# Altium project shkb.PrjPcb
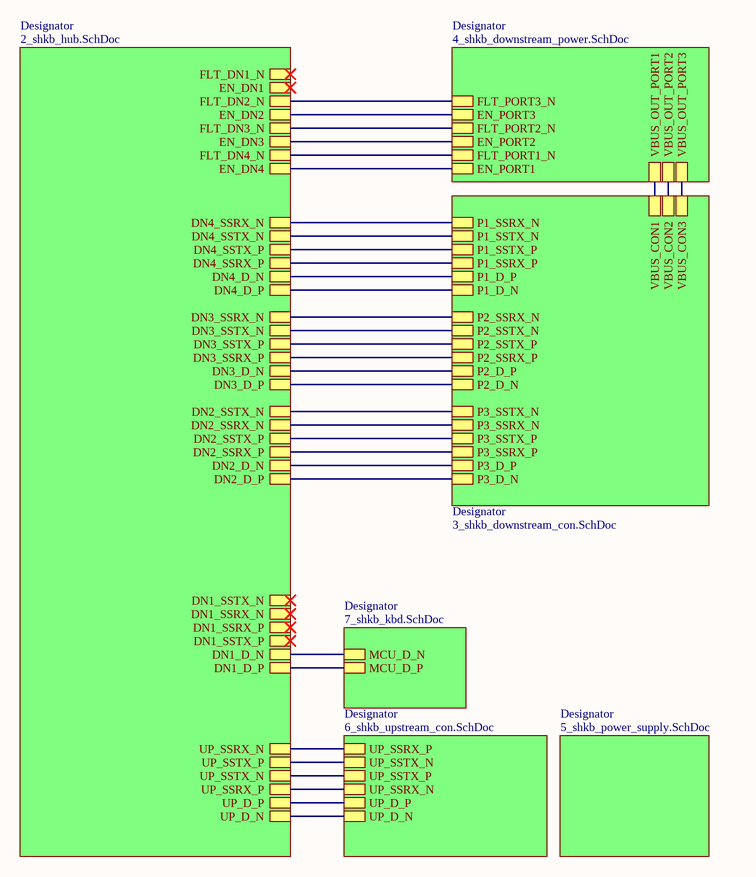
[diagram p0: 1_shkb_top.SchDoc]
ProjectTitle: Steezy Hacking Keyboard Controller; Revision: B3
7 sheets, 143 parts. Net scope: hierarchical (ports join the sheet entries above them; power ports are global).
Board file: shkb.PcbDoc
Sheets:
  1_shkb_top.SchDoc
    Designator = 4_shkb_downstream_power.SchDoc
    Designator = 2_shkb_hub.SchDoc
    Designator = 3_shkb_downstream_con.SchDoc
    Designator = 6_shkb_upstream_con.SchDoc
    Designator = 7_shkb_kbd.SchDoc
    Designator = 5_shkb_power_supply.SchDoc

## Sheet 1_shkb_top.SchDoc: =ProjectTitle
size A4; Address1: github.com/4pplet/SHKB; Address2: Licence: CERN-OHL-S; Revision: B3; SheetNumber: 1; SheetTotal: 7

### Sub-sheets
Designator = 4_shkb_downstream_power.SchDoc: VBUS_OUT_PORT2, FLT_PORT2_N, EN_PORT1, VBUS_OUT_PORT1, FLT_PORT1_N, EN_PORT2, FLT_PORT3_N, VBUS_OUT_PORT3, EN_PORT3
Designator = 2_shkb_hub.SchDoc: FLT_DN2_N, EN_DN2, EN_DN3, EN_DN1, FLT_DN3_N, FLT_DN1_N, FLT_DN4_N, EN_DN4, DN4_D_P, DN1_SSRX_N, DN4_D_N, DN4_SSTX_P, DN4_SSTX_N, DN4_SSRX_P, DN4_SSRX_N, UP_SSRX_P, UP_SSRX_N, UP_SSTX_N, UP_SSTX_P, UP_D_N, UP_D_P, DN3_D_P, DN3_SSRX_P, DN3_SSRX_N, DN3_D_N, DN3_SSTX_P, DN3_SSTX_N, DN2_D_P, DN2_D_N, DN2_SSTX_P, DN2_SSTX_N, DN2_SSRX_P, DN2_SSRX_N, DN1_D_P, DN1_D_N, DN1_SSTX_P, DN1_SSTX_N, DN1_SSRX_P
Designator = 3_shkb_downstream_con.SchDoc: VBUS_CON1, VBUS_CON2, P2_SSTX_N, P2_SSTX_P, P1_SSTX_N, P1_SSRX_P, P2_SSRX_P, P2_SSRX_N, P1_SSRX_N, P1_D_P, P2_D_N, P2_D_P, P1_SSTX_P, P1_D_N, P3_SSRX_N, VBUS_CON3, P3_SSTX_P, P3_D_P, P3_SSTX_N, P3_D_N, P3_SSRX_P
Designator = 6_shkb_upstream_con.SchDoc: UP_SSRX_N, UP_SSTX_N, UP_D_P, UP_D_N, UP_SSRX_P, UP_SSTX_P
Designator = 7_shkb_kbd.SchDoc: MCU_D_P, MCU_D_N
Designator = 5_shkb_power_supply.SchDoc: no entries

### Nets
MCU_D_N: sheet Designator/DN1_D_N, sheet Designator/MCU_D_N
MCU_D_P: sheet Designator/DN1_D_P, sheet Designator/MCU_D_P
P1_D_N: sheet Designator/DN4_D_P, sheet Designator/P1_D_N
P1_D_P: sheet Designator/DN4_D_N, sheet Designator/P1_D_P
P1_SSRX_N: sheet Designator/DN4_SSRX_N, sheet Designator/P1_SSRX_N
P1_SSRX_P: sheet Designator/DN4_SSRX_P, sheet Designator/P1_SSRX_P
P1_SSTX_N: sheet Designator/DN4_SSTX_N, sheet Designator/P1_SSTX_N
P1_SSTX_P: sheet Designator/DN4_SSTX_P, sheet Designator/P1_SSTX_P
P2_D_N: sheet Designator/DN3_D_P, sheet Designator/P2_D_N
P2_D_P: sheet Designator/DN3_D_N, sheet Designator/P2_D_P
P2_SSRX_N: sheet Designator/DN3_SSRX_N, sheet Designator/P2_SSRX_N
P2_SSRX_P: sheet Designator/DN3_SSRX_P, sheet Designator/P2_SSRX_P
P2_SSTX_N: sheet Designator/DN3_SSTX_N, sheet Designator/P2_SSTX_N
P2_SSTX_P: sheet Designator/DN3_SSTX_P, sheet Designator/P2_SSTX_P
P3_D_N: sheet Designator/DN2_D_P, sheet Designator/P3_D_N
P3_D_P: sheet Designator/DN2_D_N, sheet Designator/P3_D_P
P3_SSRX_N: sheet Designator/DN2_SSRX_N, sheet Designator/P3_SSRX_N
P3_SSRX_P: sheet Designator/DN2_SSRX_P, sheet Designator/P3_SSRX_P
P3_SSTX_N: sheet Designator/DN2_SSTX_N, sheet Designator/P3_SSTX_N
P3_SSTX_P: sheet Designator/DN2_SSTX_P, sheet Designator/P3_SSTX_P
UP_D_N: sheet Designator/UP_D_N, sheet Designator/UP_D_N
UP_D_P: sheet Designator/UP_D_P, sheet Designator/UP_D_P
UP_SSRX_N: sheet Designator/UP_SSRX_P, sheet Designator/UP_SSRX_N
UP_SSRX_P: sheet Designator/UP_SSRX_N, sheet Designator/UP_SSRX_P
UP_SSTX_N: sheet Designator/UP_SSTX_P, sheet Designator/UP_SSTX_N
UP_SSTX_P: sheet Designator/UP_SSTX_N, sheet Designator/UP_SSTX_P
NetC403_2: sheet Designator/VBUS_OUT_PORT1, sheet Designator/VBUS_CON1
NetC406_2: sheet Designator/VBUS_OUT_PORT2, sheet Designator/VBUS_CON2
NetC409_2: sheet Designator/VBUS_OUT_PORT3, sheet Designator/VBUS_CON3
NetR401_1: sheet Designator/EN_PORT1, sheet Designator/EN_DN4
NetR403_1: sheet Designator/EN_PORT2, sheet Designator/EN_DN3
NetR405_1: sheet Designator/EN_PORT3, sheet Designator/EN_DN2
NetU201_43: sheet Designator/FLT_PORT1_N, sheet Designator/FLT_DN4_N
NetU201_44: sheet Designator/FLT_PORT2_N, sheet Designator/FLT_DN3_N
NetU201_47: sheet Designator/FLT_PORT3_N, sheet Designator/FLT_DN2_N

### Notes on the sheet
- Title
- Size:
- Date:
- A4
- Number:
- Time:
- Revision:
- Sheet
- of
- File:

## Sheet 4_shkb_downstream_power.SchDoc: =ProjectTitle
size A4; Address1: github.com/4pplet/SHKB; Address2: Licence: CERN-OHL-S; Revision: B3; SheetNumber: 4; SheetTotal: 7
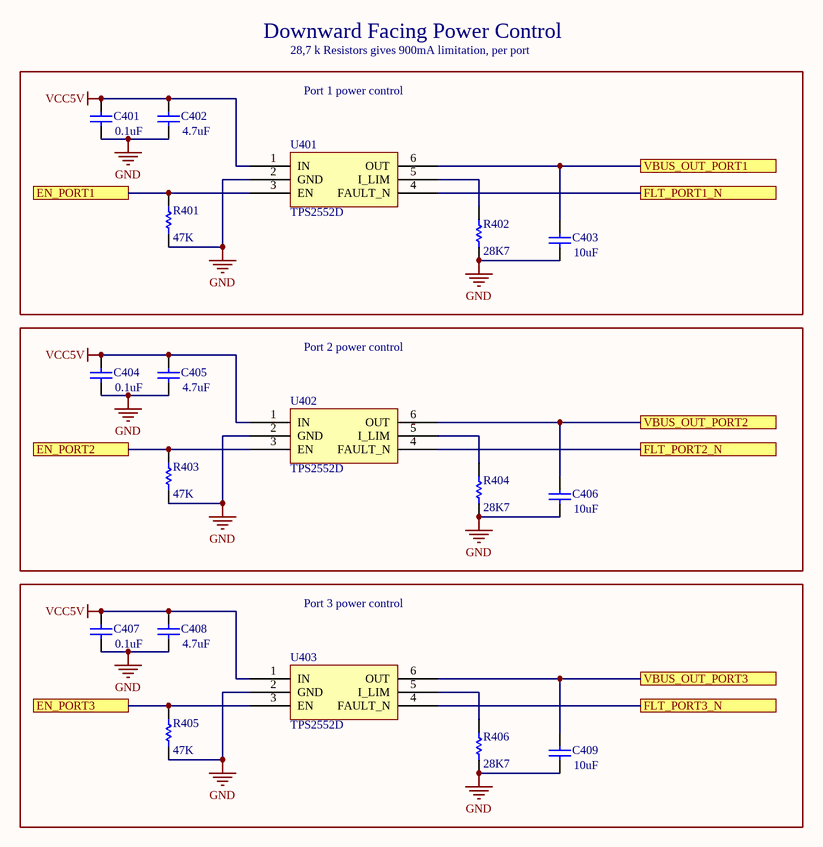
[diagram p1: 4_shkb_downstream_power.SchDoc]

### Parts
C401  value 0.1uF  [C0603[1608]]
C402  value 4.7uF  [C1206[3216]]
C403  value 10uF  [C1206[3216]]
C404  value 0.1uF  [C0603[1608]]
C405  value 4.7uF  [C1206[3216]]
C406  value 10uF  [C1206[3216]]
C407  value 0.1uF  [C0603[1608]]
C408  value 4.7uF  [C1206[3216]]
C409  value 10uF  [C1206[3216]]
R401  value 47K  [R0603[1608]]
R402  value 28K7  [R0603[1608]]
R403  value 47K  [R0603[1608]]
R404  value 28K7  [R0603[1608]]
R405  value 47K  [R0603[1608]]
R406  value 28K7  [R0603[1608]]
U401  TPS2552D  [SOT-23-6]
U402  TPS2552D  [SOT-23-6]
U403  TPS2552D  [SOT-23-6]

### Blocks framed on the sheet
Port 2 power control: C404-C406 R403 R404 U402
Port 3 power control: C407-C409 R405 R406 U403

### Ports
EN_PORT1, EN_PORT2, EN_PORT3, FLT_PORT1_N, FLT_PORT2_N, FLT_PORT3_N, VBUS_OUT_PORT1, VBUS_OUT_PORT2, VBUS_OUT_PORT3

### Nets
GND: C401.1 C402.1 C403.1 C404.1 C405.1 C406.1 C407.1 C408.1 C409.1 R401.2 R402.2 R403.2 R404.2 R405.2 R406.2 U401.2(GND) U402.2(GND) U403.2(GND)
VCC5V: C401.2 C402.2 C404.2 C405.2 C407.2 C408.2 U401.1(IN) U402.1(IN) U403.1(IN)
NetC403_2: C403.2 U401.6(OUT) ; port VBUS_OUT_PORT1
NetC406_2: C406.2 U402.6(OUT) ; port VBUS_OUT_PORT2
NetC409_2: C409.2 U403.6(OUT) ; port VBUS_OUT_PORT3
NetR401_1: R401.1 U401.3(EN) ; port EN_PORT1
NetR402_1: R402.1 U401.5(I_LIM)
NetR403_1: R403.1 U402.3(EN) ; port EN_PORT2
NetR404_1: R404.1 U402.5(I_LIM)
NetR405_1: R405.1 U403.3(EN) ; port EN_PORT3
NetR406_1: R406.1 U403.5(I_LIM)
NetU201_43: U401.4(FAULT_N) ; port FLT_PORT1_N
NetU201_44: U402.4(FAULT_N) ; port FLT_PORT2_N
NetU201_47: U403.4(FAULT_N) ; port FLT_PORT3_N

### Notes on the sheet
- Downward Facing Power Control
- 28,7 k Resistors gives 900mA limitation, per port
- Port 1 power control
- Title
- Size:
- Date:
- A4
- Number:
- Time:
- Revision:
- Sheet
- of
- File:

### Library data of the parts
C401 C404 C407 = Cap: Capacitor; MRF.Part: CC0603KRX7R9BB104; MFG: KEMET; MFGPN: C0603C104M5RACTU; LCSC MFG: YAGEO; Version: 0603 imperial; JLC: BASIC; LCSC Part #: C14663
C402 C405 C408 = Cap: Capacitor; MRF.Part: 1206B475K500NT; MFG: KEMET; MFGPN: C1206C475K4PACTU; LCSC MFG: Guangdong Fenghua Advanced Tech; Version: 1206 imperial; JLC: BASIC; LCSC Part #: C29823
C403 C406 C409 = Cap: Capacitor; MRF.Part: CL31A106KBHNNNE; MFG: KEMET; MFGPN: C1206C106K4PACTU; LCSC MFG: Samsung Electro-Mechanics; Version: 1206 imperial; JLC: BASIC; LCSC Part #: C13585
R401 R403 R405 = Res1: Resistor; MRF.Part: 0603WAF4702T5E; MFG: Vishay Dale; MFGPN: RCA060347K0FKEA; LCSC MFG: Uniroyal Elec; Version: 0603 imperial; JLC: BASIC; LCSC Part #: C25819
R402 R404 R406 = Res1: Resistor; MRF.Part: 0603WAF2872T5E; MFG: Vishay Dale; MFGPN: CRCW060328K7FKEA; LCSC MFG: Uniroyal Elec; Version: 0603 imperial; JLC: BASIC; LCSC Part #: C22928
U401-U403 = TPS2552D: MRF.Part: TPS2552DBVR-1; LCSC MFG: Texas Instruments; LCSC Part #: C140331; JLC: EXTENDED

## Sheet 2_shkb_hub.SchDoc: =ProjectTitle
size A4; Address1: github.com/4pplet/SHKB; Address2: Licence: CERN-OHL-S; Revision: B3; SheetNumber: 2; SheetTotal: 7
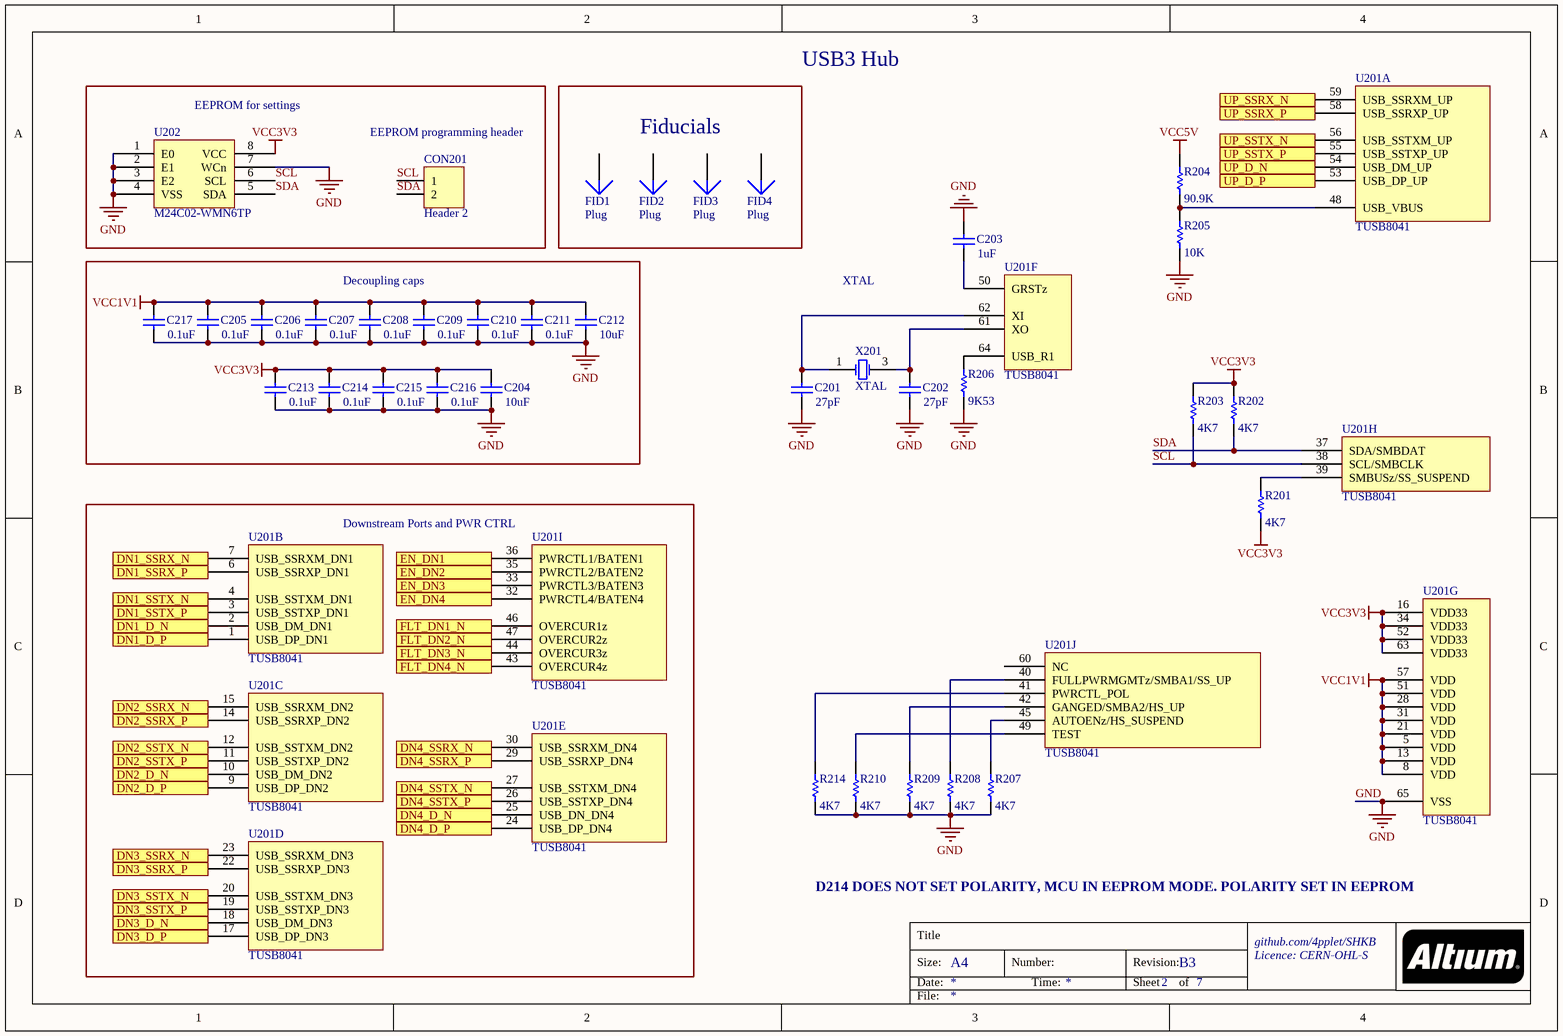
[diagram p2: 2_shkb_hub.SchDoc]

### Parts
C201  value 27pF  [C0603[1608]]
C202  value 27pF  [C0603[1608]]
C203  value 1uF  [C0603[1608]]
C204  value 10uF  [C1206[3216]]
C205  value 0.1uF  [C0402[1005]]
C206  value 0.1uF  [C0402[1005]]
C207  value 0.1uF  [C0402[1005]]
C208  value 0.1uF  [C0402[1005]]
C209  value 0.1uF  [C0402[1005]]
C210  value 0.1uF  [C0603[1608]]
C211  value 0.1uF  [C0603[1608]]
C212  value 10uF  [C1206[3216]]
C213  value 0.1uF  [C0402[1005]]
C214  value 0.1uF  [C0603[1608]]
C215  value 0.1uF  [C0603[1608]]
C216  value 0.1uF  [C0603[1608]]
C217  value 0.1uF  [C0402[1005]]
CON201  Header 2  [HDR1X2]  (no BOM)
FID1  Plug  [Fiducial_Nordic]  (no BOM)
FID2  Plug  [Fiducial_Nordic]  (no BOM)
FID3  Plug  [Fiducial_Nordic]  (no BOM)
FID4  Plug  [Fiducial_Nordic]  (no BOM)
R201  value 4K7  [R0603[1608]]
R202  value 4K7  [R0603[1608]]
R203  value 4K7  [R0603[1608]]
R204  value 90.9K  [R0603[1608]]
R205  value 10K  [R0603[1608]]
R206  value 9K53  [R0402[1005]]
R207  value 4K7  [R0603[1608]]
R208  value 4K7  [R0603[1608]]
R209  value 4K7  [R0603[1608]]
R210  value 4K7  [R0603[1608]]
R214  value 4K7  [R0603[1608]]
U201  TUSB8041  [TUSB8041_VQFN]  (parts A,B,C,D,E,F,G,H,I,J of 10)
U202  M24C02-WMN6TP  [STMicroelectronics M24C02-WMN6TP]
X201  XTAL  [XTAL-3225]

### Blocks framed on the sheet
Decoupling caps: C204-C217
Downstream Ports and PWR CTRL: U201

### Ports
DN1_D_N, DN1_D_P, DN1_SSRX_N, DN1_SSRX_P, DN1_SSTX_N, DN1_SSTX_P, DN2_D_N, DN2_D_P, DN2_SSRX_N, DN2_SSRX_P, DN2_SSTX_N, DN2_SSTX_P, DN3_D_N, DN3_D_P, DN3_SSRX_N, DN3_SSRX_P, DN3_SSTX_N, DN3_SSTX_P, DN4_D_N, DN4_D_P, DN4_SSRX_N, DN4_SSRX_P, DN4_SSTX_N, DN4_SSTX_P, EN_DN1, EN_DN2, EN_DN3, EN_DN4, FLT_DN1_N, FLT_DN2_N, FLT_DN3_N, FLT_DN4_N, UP_D_N, UP_D_P, UP_SSRX_N, UP_SSRX_P, UP_SSTX_N, UP_SSTX_P

### Nets
GND: C201.1 C202.1 C203.2 C204.1 C205.1 C206.1 C207.1 C208.1 C209.1 C210.1 C211.1 C212.1 C213.1 C214.1 C215.1 C216.1 C217.1 R205.2 R206.1 R207.1 R208.1 R209.1 R210.1 R214.1 U201.65(VSS) U202.1(E0) U202.2(E1) U202.3(E2) U202.4(VSS) U202.7(WCn) X201.2(GND) X201.4(GND)
VCC1V1: C205.2 C206.2 C207.2 C208.2 C209.2 C210.2 C211.2 C212.2 C217.2 U201.5(VDD) U201.8(VDD) U201.13(VDD) U201.21(VDD) U201.28(VDD) U201.31(VDD) U201.51(VDD) U201.57(VDD)
VCC3V3: C204.2 C213.2 C214.2 C215.2 C216.2 R201.1 R202.2 R203.2 U201.16(VDD33) U201.34(VDD33) U201.52(VDD33) U201.63(VDD33) U202.8(VCC)
VCC5V: R204.2
MCU_D_N: U201.2(USB_DM_DN1) ; port DN1_D_N
MCU_D_P: U201.1(USB_DP_DN1) ; port DN1_D_P
P1_D_N: U201.24(USB_DP_DN4) ; port DN4_D_P
P1_D_P: U201.25(USB_DN_DN4) ; port DN4_D_N
P1_SSRX_N: U201.30(USB_SSRXM_DN4) ; port DN4_SSRX_N
P1_SSRX_P: U201.29(USB_SSRXP_DN4) ; port DN4_SSRX_P
P1_SSTX_N: U201.27(USB_SSTXM_DN4) ; port DN4_SSTX_N
P1_SSTX_P: U201.26(USB_SSTXP_DN4) ; port DN4_SSTX_P
P2_D_N: U201.17(USB_DP_DN3) ; port DN3_D_P
P2_D_P: U201.18(USB_DM_DN3) ; port DN3_D_N
P2_SSRX_N: U201.23(USB_SSRXM_DN3) ; port DN3_SSRX_N
P2_SSRX_P: U201.22(USB_SSRXP_DN3) ; port DN3_SSRX_P
P2_SSTX_N: U201.20(USB_SSTXM_DN3) ; port DN3_SSTX_N
P2_SSTX_P: U201.19(USB_SSTXP_DN3) ; port DN3_SSTX_P
P3_D_N: U201.9(USB_DP_DN2) ; port DN2_D_P
P3_D_P: U201.10(USB_DM_DN2) ; port DN2_D_N
P3_SSRX_N: U201.15(USB_SSRXM_DN2) ; port DN2_SSRX_N
P3_SSRX_P: U201.14(USB_SSRXP_DN2) ; port DN2_SSRX_P
P3_SSTX_N: U201.12(USB_SSTXM_DN2) ; port DN2_SSTX_N
P3_SSTX_P: U201.11(USB_SSTXP_DN2) ; port DN2_SSTX_P
SCL: CON201.1 R203.1 U201.38(SCL/SMBCLK) U202.6(SCL)
SDA: CON201.2 R202.1 U201.37(SDA/SMBDAT) U202.5(SDA)
UP_D_N: U201.54(USB_DM_UP) ; port UP_D_N
UP_D_P: U201.53(USB_DP_UP) ; port UP_D_P
UP_SSRX_N: U201.58(USB_SSRXP_UP) ; port UP_SSRX_P
UP_SSRX_P: U201.59(USB_SSRXM_UP) ; port UP_SSRX_N
UP_SSTX_N: U201.55(USB_SSTXP_UP) ; port UP_SSTX_P
UP_SSTX_P: U201.56(USB_SSTXM_UP) ; port UP_SSTX_N
NetC201_2: C201.2 U201.62(XI) X201.1(OSC1)
NetC202_2: C202.2 U201.61(XO) X201.3(OSC2)
NetC203_1: C203.1 U201.50(GRSTz)
NetR201_2: R201.2 U201.39(SMBUSz/SS_SUSPEND)
NetR204_1: R204.1 R205.1 U201.48(USB_VBUS)
NetR206_2: R206.2 U201.64(USB_R1)
NetR207_2: R207.2 U201.45(AUTOENz/HS_SUSPEND)
NetR208_2: R208.2 U201.40(FULLPWRMGMTz/SMBA1/SS_UP)
NetR209_2: R209.2 U201.42(GANGED/SMBA2/HS_UP)
NetR210_2: R210.2 U201.49(TEST)
NetR214_2: R214.2 U201.41(PWRCTL_POL)
NetR401_1: U201.32(PWRCTL4/BATEN4) ; port EN_DN4
NetR403_1: U201.33(PWRCTL3/BATEN3) ; port EN_DN3
NetR405_1: U201.35(PWRCTL2/BATEN2) ; port EN_DN2
NetU201_3: U201.3(USB_SSTXP_DN1) ; port DN1_SSTX_P
NetU201_4: U201.4(USB_SSTXM_DN1) ; port DN1_SSTX_N
NetU201_6: U201.6(USB_SSRXP_DN1) ; port DN1_SSRX_P
NetU201_7: U201.7(USB_SSRXM_DN1) ; port DN1_SSRX_N
NetU201_36: U201.36(PWRCTL1/BATEN1) ; port EN_DN1
NetU201_43: U201.43(OVERCUR4z) ; port FLT_DN4_N
NetU201_44: U201.44(OVERCUR3z) ; port FLT_DN3_N
NetU201_46: U201.46(OVERCUR1z) ; port FLT_DN1_N
NetU201_47: U201.47(OVERCUR2z) ; port FLT_DN2_N

Not connected (* = marked no-connect by the designer): FID1 1; FID2 1; FID3 1; FID4 1; U201 60(NC)

### Notes on the sheet
- (near U202) EEPROM for settings
- USB3 Hub
- (near CON201) EEPROM programming header
- Fiducials
- XTAL
- D214 DOES NOT SET POLARITY, MCU IN EEPROM MODE. POLARITY SET IN EEPROM
- Title
- Size:
- Date:
- A4
- Number:
- Time:
- Revision:
- Sheet
- of
- File:

### Library data of the parts
C201 C202 = Cap: Capacitor; MRF.Part: CL10C270JB8NNNC; LCSC MFG: Samsung Electro-Mechanics; Version: 0603 imperial; JLC: BASIC; LCSC Part #: C1656
C203 = Cap: Capacitor; MRF.Part: CL10A105KB8NNNC; MFG: KEMET; MFGPN: C0603C105K4RACTU; LCSC MFG: Samsung Electro-Mechanics; Version: 0603 imperial; JLC: BASIC; LCSC Part #: C15849
C204 C212 = Cap: as C403 on sheet 4_shkb_downstream_power; Version: 1206 imperial; JLC: BASIC; LCSC Part #: C13585
C205-C209 C213 C217 = Cap: Capacitor; MRF.Part: CL05B104KO5NNNC; MFG: KEMET; MFGPN: C0402C104K8PACTU; LCSC MFG: Samsung Electro-Mechanics; Version: 0402 imperial; JLC: BASIC; LCSC Part #: C1525
C210 C211 C214-C216 = Cap: as C401 on sheet 4_shkb_downstream_power; Version: 0603 imperial; JLC: BASIC; LCSC Part #: C14663
CON201 = Header 2: Header, 2-Pin; LatestRevisionDate: 17-Jul-2002; LatestRevisionNote: Re-released for DXP Platform.; Publisher: Altium Limited
R201-R203 R207-R210 R214 = Res1: Resistor; MRF.Part: 0603WAF4701T5E; MFG: Vishay Dale; MFGPN: RCA06034K70FKEA; LCSC MFG: Uniroyal Elec; Version: 0603 imperial; JLC: BASIC; LCSC Part #: C23162
R204 = Res1: Resistor; MRF.Part: TC0325D9092T5E; MFG: Vishay Dale; MFGPN: CRCW060390K9FKEA; LCSC MFG: Uniroyal Elec; Version: 0603 imperial; JLC: EXTENDED; LCSC Part #: C51222
R205 = Res1: Resistor; MRF.Part: 0603WAF1002T5E; MFG: Vishay Dale; MFGPN: RCA060310K0FKEA; LCSC MFG: Uniroyal Elec; Version: 0603 imperial; JLC: BASIC; LCSC Part #: C25804
R206 = Res1: Resistor; MRF.Part: 0402WGF9531TCE; LCSC MFG: Uniroyal Elec; Version: 0402 imperial; JLC: EXTENDED; LCSC Part #: C96273
U201 = TUSB8041: MRF.Part: TUSB8042RGCR; MFG: Texas Instruments; MFGPN: TUSB8042RGCT; LCSC MFG: Texas Instruments; LCSC Part #: C702389; JLC: NONE
U202 = STMicroelectronics M24C02-WMN6TP: Value: 2KB; JLC: BASIC; LCSC MFG: STMicroelectronics; LCSC Part #: C7562; MRF.Part: M24C02-WMN6TP; Version: SO8 2KB
X201 = XTAL: Crystal Oscillator; MRF.Part: X1E0000210264; MFG: EPSON; MFGPN: TSX-3225 24.0000MF18X-C0; Value: 24MHZ; LCSC MFG: Seiko Epson; Version: 3225, 18pF; LCSC Part #: C91744; JLC: EXTENDED
FID1-FID4 = Plug: JLC: DNP

## Sheet 3_shkb_downstream_con.SchDoc: =ProjectTitle
size A4; Address1: github.com/4pplet/SHKB; Address2: Licence: CERN-OHL-S; Revision: B3; SheetNumber: 3; SheetTotal: 7
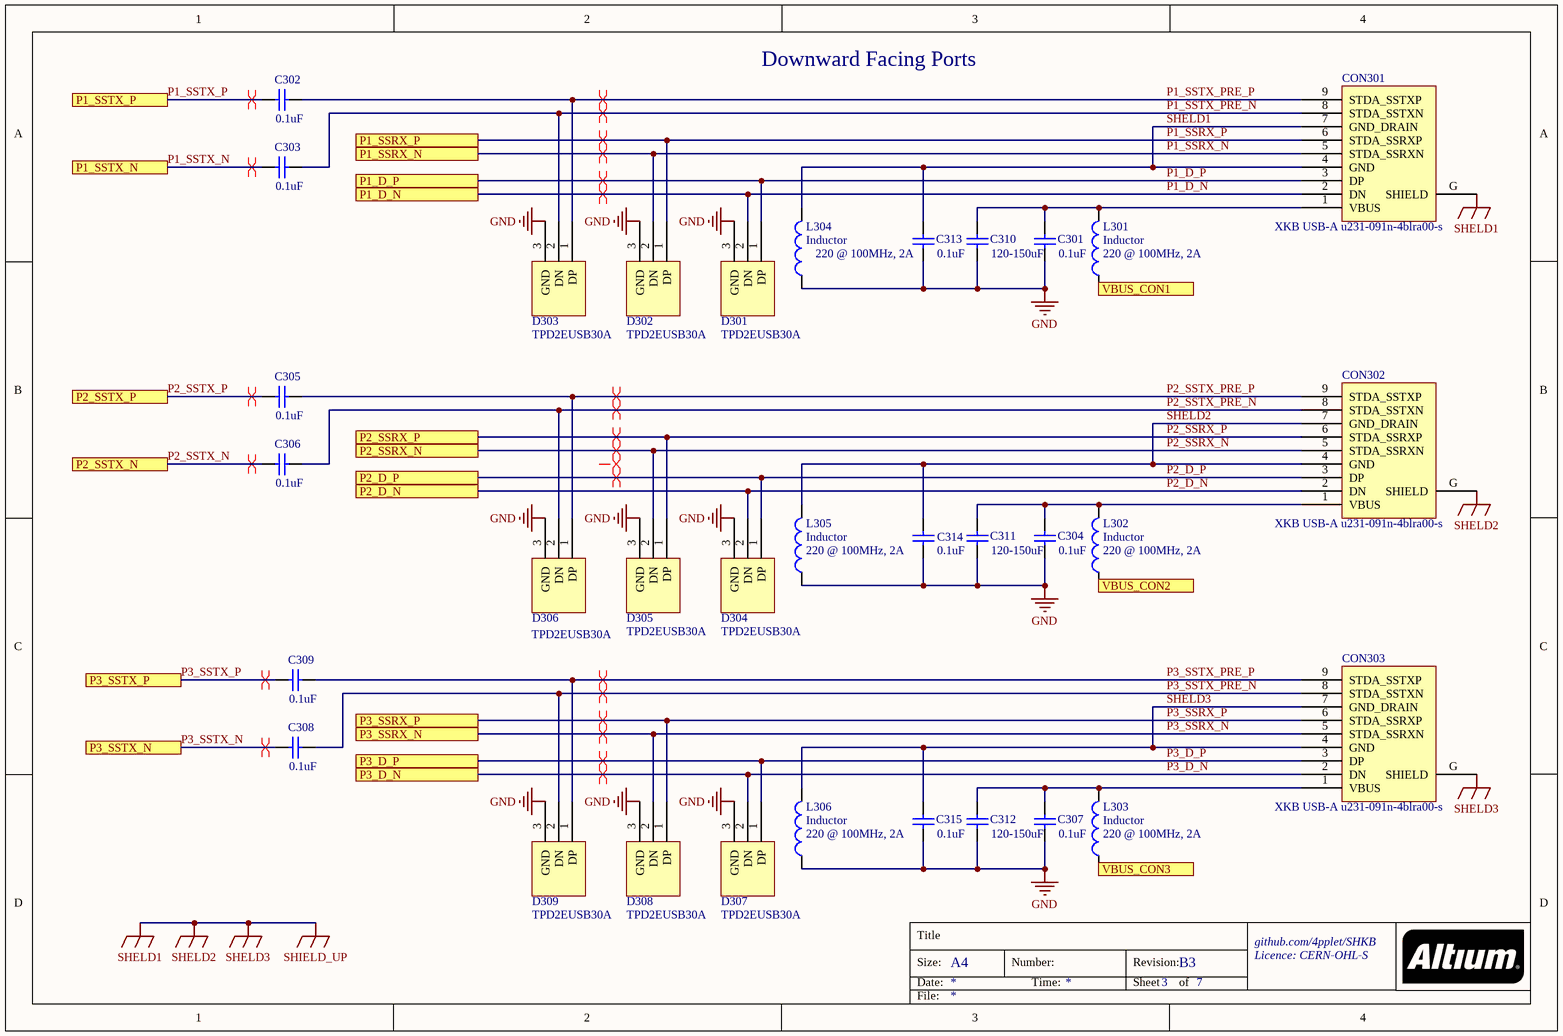
[diagram p3: 3_shkb_downstream_con.SchDoc]

### Parts
C301  value 0.1uF  [C0603[1608]]
C302  value 0.1uF  [C0402[1005]]
C303  value 0.1uF  [C0402[1005]]
C304  value 0.1uF  [C0603[1608]]
C305  value 0.1uF  [C0402[1005]]
C306  value 0.1uF  [C0402[1005]]
C307  value 0.1uF  [C0603[1608]]
C308  value 0.1uF  [C0402[1005]]
C309  value 0.1uF  [C0402[1005]]
C310  value 120-150uF  [C_9L_9M]
C311  value 120-150uF  [C_9L_9M]
C312  value 120-150uF  [C_9L_9M]
C313  value 0.1uF  [C0603[1608]]  (no BOM)
C314  value 0.1uF  [C0603[1608]]  (no BOM)
C315  value 0.1uF  [C0603[1608]]  (no BOM)
CON301  XKB USB-A u231-091n-4blra00-s  [XKB USB-A u231-091n-4blra00-s]
CON302  XKB USB-A u231-091n-4blra00-s  [XKB USB-A u231-091n-4blra00-s]
CON303  XKB USB-A u231-091n-4blra00-s  [XKB USB-A u231-091n-4blra00-s]
D301  TPD2EUSB30A  [TPD2EUSB30A]
D302  TPD2EUSB30A  [TPD2EUSB30A]
D303  TPD2EUSB30A  [TPD2EUSB30A]
D304  TPD2EUSB30A  [TPD2EUSB30A]
D305  TPD2EUSB30A  [TPD2EUSB30A]
D306  TPD2EUSB30A  [TPD2EUSB30A]
D307  TPD2EUSB30A  [TPD2EUSB30A]
D308  TPD2EUSB30A  [TPD2EUSB30A]
D309  TPD2EUSB30A  [TPD2EUSB30A]
L301  Inductor  value 220 @ 100MHz, 2A  [L0603[1608]]
L302  Inductor  value 220 @ 100MHz, 2A  [L0603[1608]]
L303  Inductor  value 220 @ 100MHz, 2A  [L0603[1608]]
L304  Inductor  value 220 @ 100MHz, 2A  [L0603[1608]]
L305  Inductor  value 220 @ 100MHz, 2A  [L0603[1608]]
L306  Inductor  value 220 @ 100MHz, 2A  [L0603[1608]]

### Ports
P1_D_N, P1_D_P, P1_SSRX_N, P1_SSRX_P, P1_SSTX_N, P1_SSTX_P, P2_D_N, P2_D_P, P2_SSRX_N, P2_SSRX_P, P2_SSTX_N, P2_SSTX_P, P3_D_N, P3_D_P, P3_SSRX_N, P3_SSRX_P, P3_SSTX_N, P3_SSTX_P, VBUS_CON1, VBUS_CON2, VBUS_CON3

### Nets
GND: C301.1 C304.1 C307.1 C310.1 C311.1 C312.1 C313.1 C314.1 C315.1 D301.3(GND) D302.3(GND) D303.3(GND) D304.3(GND) D305.3(GND) D306.3(GND) D307.3(GND) D308.3(GND) D309.3(GND) L304.1 L305.1 L306.1
SHELD1: C313.2 C314.2 C315.2 CON301.4(GND) CON301.7(GND_DRAIN) CON301.G(SHIELD) CON302.4(GND) CON302.7(GND_DRAIN) CON302.G(SHIELD) CON303.4(GND) CON303.7(GND_DRAIN) CON303.G(SHIELD) L304.2 L305.2 L306.2  [also labelled SHELD2, SHELD3, SHIELD_UP]
P1_D_N: CON301.2(DN) D301.2(DN) ; port P1_D_N
P1_D_P: CON301.3(DP) D301.1(DP) ; port P1_D_P
P1_SSRX_N: CON301.5(STDA_SSRXN) D302.2(DN) ; port P1_SSRX_N
P1_SSRX_P: CON301.6(STDA_SSRXP) D302.1(DP) ; port P1_SSRX_P
P1_SSTX_N: C303.2 ; port P1_SSTX_N
P1_SSTX_P: C302.2 ; port P1_SSTX_P
P1_SSTX_PRE_N: C303.1 CON301.8(STDA_SSTXN) D303.2(DN)
P1_SSTX_PRE_P: C302.1 CON301.9(STDA_SSTXP) D303.1(DP)
P2_D_N: CON302.2(DN) D304.2(DN) ; port P2_D_N
P2_D_P: CON302.3(DP) D304.1(DP) ; port P2_D_P
P2_SSRX_N: CON302.5(STDA_SSRXN) D305.2(DN) ; port P2_SSRX_N
P2_SSRX_P: CON302.6(STDA_SSRXP) D305.1(DP) ; port P2_SSRX_P
P2_SSTX_N: C306.1 ; port P2_SSTX_N
P2_SSTX_P: C305.1 ; port P2_SSTX_P
P2_SSTX_PRE_N: C306.2 CON302.8(STDA_SSTXN) D306.2(DN)
P2_SSTX_PRE_P: C305.2 CON302.9(STDA_SSTXP) D306.1(DP)
P3_D_N: CON303.2(DN) D307.2(DN) ; port P3_D_N
P3_D_P: CON303.3(DP) D307.1(DP) ; port P3_D_P
P3_SSRX_N: CON303.5(STDA_SSRXN) D308.2(DN) ; port P3_SSRX_N
P3_SSRX_P: CON303.6(STDA_SSRXP) D308.1(DP) ; port P3_SSRX_P
P3_SSTX_N: C308.1 ; port P3_SSTX_N
P3_SSTX_P: C309.1 ; port P3_SSTX_P
P3_SSTX_PRE_N: C308.2 CON303.8(STDA_SSTXN) D309.2(DN)
P3_SSTX_PRE_P: C309.2 CON303.9(STDA_SSTXP) D309.1(DP)
NetC301_2: C301.2 C310.2 CON301.1(VBUS) L301.2
NetC304_2: C304.2 C311.2 CON302.1(VBUS) L302.2
NetC307_2: C307.2 C312.2 CON303.1(VBUS) L303.2
NetC403_2: L301.1 ; port VBUS_CON1
NetC406_2: L302.1 ; port VBUS_CON2
NetC409_2: L303.1 ; port VBUS_CON3

### Layout directives
differential pair: (no net found under the mark), P1_D_N, P1_D_P, P1_SSRX_N, P1_SSRX_P, P1_SSTX_N, P1_SSTX_P, P1_SSTX_PRE_N, P1_SSTX_PRE_P, P2_D_P, P2_SSRX_N, P2_SSRX_P, P2_SSTX_N, P2_SSTX_P, P2_SSTX_PRE_N, P2_SSTX_PRE_P, P3_D_N, P3_D_P, P3_SSRX_N, P3_SSRX_P, P3_SSTX_N, P3_SSTX_P, P3_SSTX_PRE_N, P3_SSTX_PRE_P

### Notes on the sheet
- Downward Facing Ports
- Title
- Size:
- Date:
- A4
- Number:
- Time:
- Revision:
- Sheet
- of
- File:

### Library data of the parts
C301 C304 C307 C313-C315 = Cap: as C401 on sheet 4_shkb_downstream_power; Version: 0603 imperial; JLC: BASIC; LCSC Part #: C14663
C302 C303 C305 C306 C308 C309 = Cap: as C205 on sheet 2_shkb_hub; Version: 0402 imperial; JLC: BASIC; LCSC Part #: C1525
C310-C312 = Cap: Capacitor; MRF.Part: OVZ121M1CTR-0807; MFG: Würth Elektronik; MFGPN: 865080349011; LCSC MFG: Lelon; Version: SMD - 9L or 9M; JLC: EXTENDED; LCSC Part #: C250088
CON301-CON303 = XKB USB-A u231-091n-4blra00-s: MRF.Part: U231-091N-4BLRA00-S-1; LCSC MFG: XKB Connectivity; LCSC Part #: C381140; JLC: NONE
D301-D305 D307-D309 = TPD2EUSB30A: MFG: Texas Instruments; MFGPN: TPD2EUSB30ADRTR; LCSC MFG: Texas Instruments; LCSC Part #: C94934; MRF.Part: TPD2EUSB30ADRTR; JLC: NONE
D306 = TPD2EUSB30A: MFGPN: TPD2EUSB30ADRTR; MFG: Texas Instruments; LCSC MFG: Texas Instruments; LCSC Part #: C94934; MRF.Part: TPD2EUSB30ADRTR; JLC: NONE
L301-L306 = Inductor: MRF.Part: BLM18KG331SN1D; MFG: Murata Electronics North America; MFGPN: BLM18KG221SN1D; LCSC MFG: Murata Electronics; Version: 0603 imperial; JLC: EXTENDED; LCSC Part #: C85832

## Sheet 6_shkb_upstream_con.SchDoc: =ProjectTitle
size A4; Address1: github.com/4pplet/SHKB; Address2: Licence: CERN-OHL-S; Revision: B3; SheetNumber: 6; SheetTotal: 7
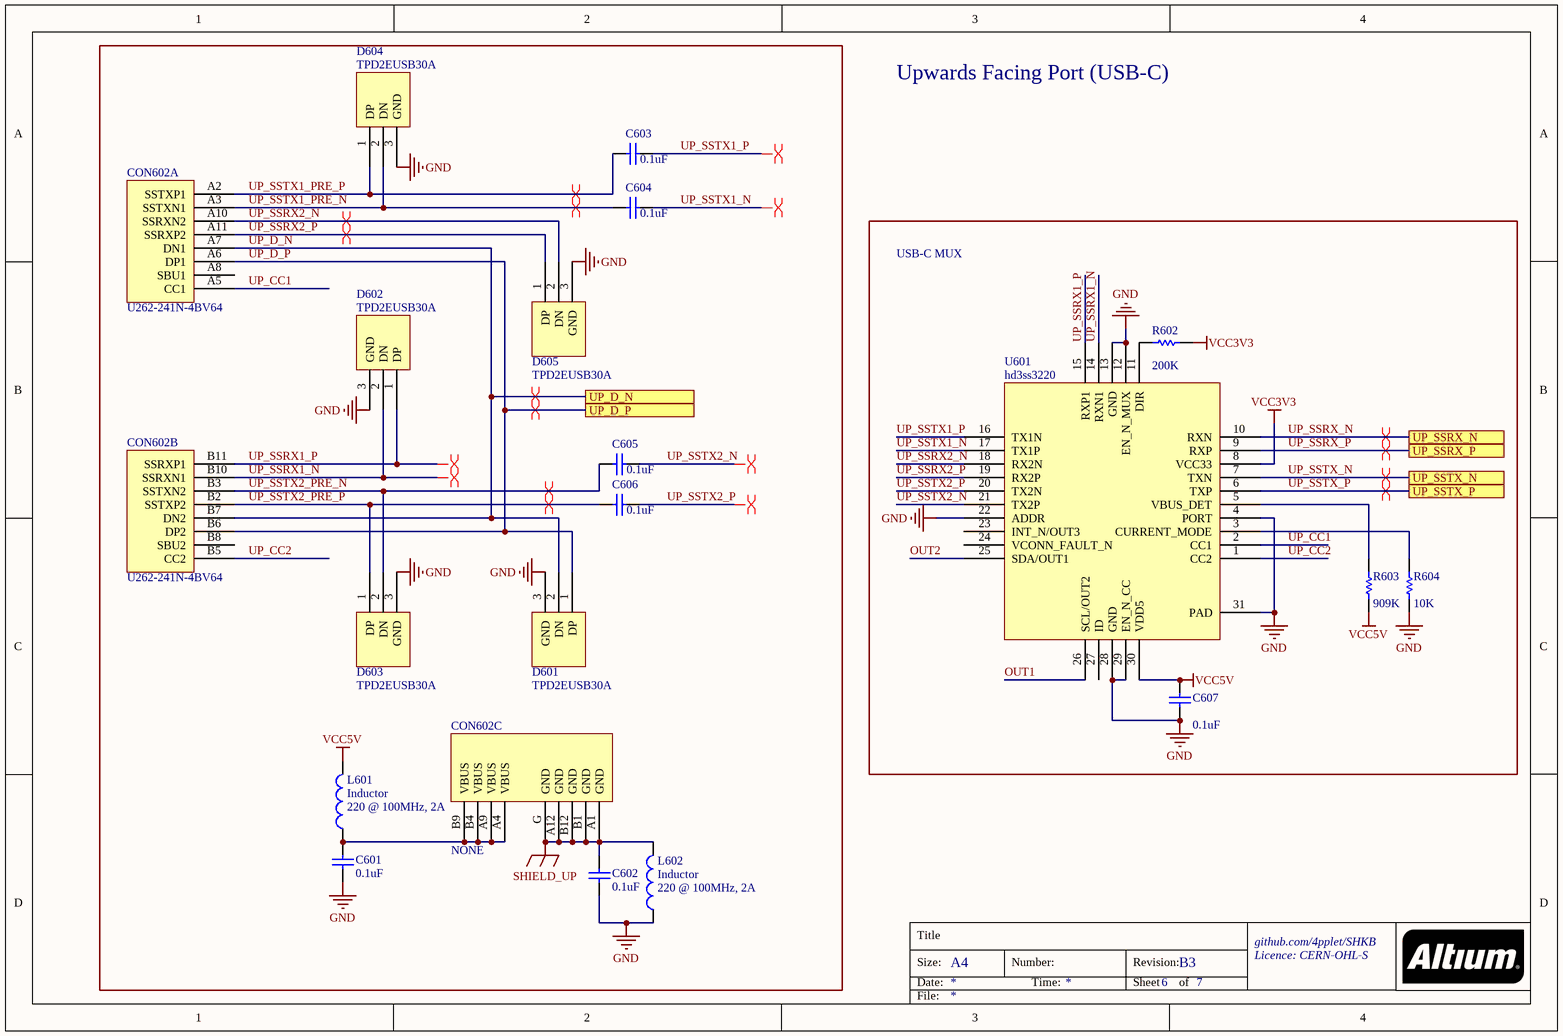
[diagram p4: 6_shkb_upstream_con.SchDoc]

### Parts
C601  value 0.1uF  [C0603[1608]]
C602  value 0.1uF  [C0603[1608]]  (no BOM)
C603  value 0.1uF  [C0402[1005]]
C604  value 0.1uF  [C0402[1005]]
C605  value 0.1uF  [C0402[1005]]
C606  value 0.1uF  [C0402[1005]]
C607  value 0.1uF  [C0603[1608]]
CON602  JLC: U262-241N-4BV64  [XKB USB-C u262-241n-4bv64]  (hidden comment: for up to 1.6mm pcb)  (parts A,B,C of 3)
D601  TPD2EUSB30A  [TPD2EUSB30A]
D602  TPD2EUSB30A  [TPD2EUSB30A]
D603  TPD2EUSB30A  [TPD2EUSB30A]
D604  TPD2EUSB30A  [TPD2EUSB30A]
D605  TPD2EUSB30A  [TPD2EUSB30A]
L601  Inductor  value 220 @ 100MHz, 2A  [L0603[1608]]
L602  Inductor  value 220 @ 100MHz, 2A  [L0603[1608]]
R602  value 200K  [R0603[1608]]
R603  value 909K  [R0603[1608]]
R604  value 10K  [R0603[1608]]
U601  hd3ss3220  [hd3ss3220]

### Blocks framed on the sheet
USB-C MUX: C607 R602-R604 U601

### Ports
UP_D_N, UP_D_P, UP_SSRX_N, UP_SSRX_P, UP_SSTX_N, UP_SSTX_P

### Nets
GND: C601.1 C602.1 C607.1 D601.3(GND) D602.3(GND) D603.3(GND) D604.3(GND) D605.3(GND) L602.1 R604.2 U601.4(PORT) U601.12(EN_N_MUX) U601.13(GND) U601.22(ADDR) U601.28(GND) U601.29(EN_N_CC) U601.31(PAD)
SHIELD_UP: C602.2 CON602.A1(GND) CON602.A12(GND) CON602.B1(GND) CON602.B12(GND) CON602.G(GND) L602.2  [project net SHELD1]
VCC3V3: R602.2 U601.8(VCC33)
VCC5V: C607.2 L601.2 R603.2 U601.30(VDD5)
OUT1: U601.26(SCL/OUT2)
OUT2: U601.25(SDA/OUT1)
UP_CC1: CON602.A5(CC1) U601.2(CC1)
UP_CC2: CON602.B5(CC2) U601.1(CC2)
UP_D_N: CON602.A7(DN1) CON602.B7(DN2) D601.2(DN) ; port UP_D_N
UP_D_P: CON602.A6(DP1) CON602.B6(DP2) D601.1(DP) ; port UP_D_P
UP_SSRX1_N: CON602.B10(SSRXN1) D602.2(DN) U601.14(RXN1)
UP_SSRX1_P: CON602.B11(SSRXP1) D602.1(DP) U601.15(RXP1)
UP_SSRX2_N: CON602.A10(SSRXN2) D605.2(DN) U601.18(RX2N)
UP_SSRX2_P: CON602.A11(SSRXP2) D605.1(DP) U601.19(RX2P)
UP_SSRX_N: U601.10(RXN) ; port UP_SSRX_N
UP_SSRX_P: U601.9(RXP) ; port UP_SSRX_P
UP_SSTX1_N: C604.2 U601.17(TX1P)
UP_SSTX1_P: C603.2 U601.16(TX1N)
UP_SSTX1_PRE_N: C604.1 CON602.A3(SSTXN1) D604.2(DN)
UP_SSTX1_PRE_P: C603.1 CON602.A2(SSTXP1) D604.1(DP)
UP_SSTX2_N: C605.2 U601.21(TX2P)
UP_SSTX2_P: C606.2 U601.20(TX2N)
UP_SSTX2_PRE_N: C605.1 CON602.B3(SSTXN2) D603.2(DN)
UP_SSTX2_PRE_P: C606.1 CON602.B2(SSTXP2) D603.1(DP)
UP_SSTX_N: U601.7(TXN) ; port UP_SSTX_N
UP_SSTX_P: U601.6(TXP) ; port UP_SSTX_P
NetC601_2: C601.2 CON602.A4(VBUS) CON602.A9(VBUS) CON602.B4(VBUS) CON602.B9(VBUS) L601.1
NetR602_1: R602.1 U601.11(DIR)
NetR603_1: R603.1 U601.5(VBUS_DET)
NetR604_1: R604.1 U601.3(CURRENT_MODE)

Not connected (* = marked no-connect by the designer): CON602 A8(SBU1) B8(SBU2); U601 23(INT_N/OUT3) 24(VCONN_FAULT_N) 27(ID)

### Layout directives
differential pair: UP_D_N, UP_D_P, UP_SSRX1_N, UP_SSRX1_P, UP_SSRX2_N, UP_SSRX2_P, UP_SSRX_N, UP_SSRX_P, UP_SSTX1_N, UP_SSTX1_P, UP_SSTX1_PRE_N, UP_SSTX1_PRE_P, UP_SSTX2_N, UP_SSTX2_P, UP_SSTX2_PRE_N, UP_SSTX2_PRE_P, UP_SSTX_N, UP_SSTX_P

### Notes on the sheet
- Upwards Facing Port (USB-C)
- Title
- Size:
- Date:
- A4
- Number:
- Time:
- Revision:
- Sheet
- of
- File:

### Library data of the parts
C601 C602 C607 = Cap: as C401 on sheet 4_shkb_downstream_power; Version: 0603 imperial; JLC: BASIC; LCSC Part #: C14663
C603-C606 = Cap: as C205 on sheet 2_shkb_hub; Version: 0402 imperial; JLC: BASIC; LCSC Part #: C1525
CON602 = XKB USB-C u262-241n-4bv64: LCSC MFG: XKB Connectivity; LCSC Part #: C388660; MRF.Part: U262-241N-4BV64
D601 = TPD2EUSB30A: MRF.Part: TPD2EUSB30DRTR-TP; MFG: Texas Instruments; MFGPN: TPD2EUSB30ADRTR; LCSC MFG: TECH PUBLIC; LCSC Part #: C2844720; JLC: NONE
D602-D605 = TPD2EUSB30A: MRF.Part: TPD2EUSB30DRTR-TP; MFGPN: TPD2EUSB30ADRTR; MFG: Texas Instruments; LCSC MFG: TECH PUBLIC; LCSC Part #: C2844720; JLC: NONE
L601 L602 = Inductor: as L301 on sheet 3_shkb_downstream_con; Version: 0603 imperial; JLC: EXTENDED; LCSC Part #: C85832
R602 = Res1: Resistor; MRF.Part: 0603WAF2003T5E; MFG: Vishay Dale; MFGPN: CRCW0603200KFKEB; LCSC MFG: Uniroyal Elec; Version: 0603 imperial; JLC: BASIC; LCSC Part #: C25811
R603 = Res1: Resistor; MRF.Part: 0603WAF9093T5E; MFG: Vishay Dale; MFGPN: CRCW0603909KFKEA; LCSC MFG: Uniroyal Elec; Version: 0603 imperial; JLC: EXTENDED; LCSC Part #: C22935
R604 = Res1: Resistor; MRF.Part: 0603WAF1002T5E; MFG: Vishay Dale; MFGPN: RCA060310K0FKEA; LCSC MFG: Uniroyal Elec C25804 Vishay Dale RCA060310K0FKEA 0603WAF1002T5E 10K; Version: 0603 imperial; JLC: BASIC; LCSC Part #: C25804
U601 = hd3ss3220: MFG: Texas Instruments; MFGPN: HD3SS3220RNHR; JLC: NONE; LCSC MFG: Texas Instruments; LCSC Part #: C165155; MRF.Part: HD3SS3220RNHR

## Sheet 7_shkb_kbd.SchDoc: =ProjectTitle
size A4; Address1: github.com/4pplet/SHKB; Address2: Licence: CERN-OHL-S; Revision: B3; SheetNumber: 7; SheetTotal: 7
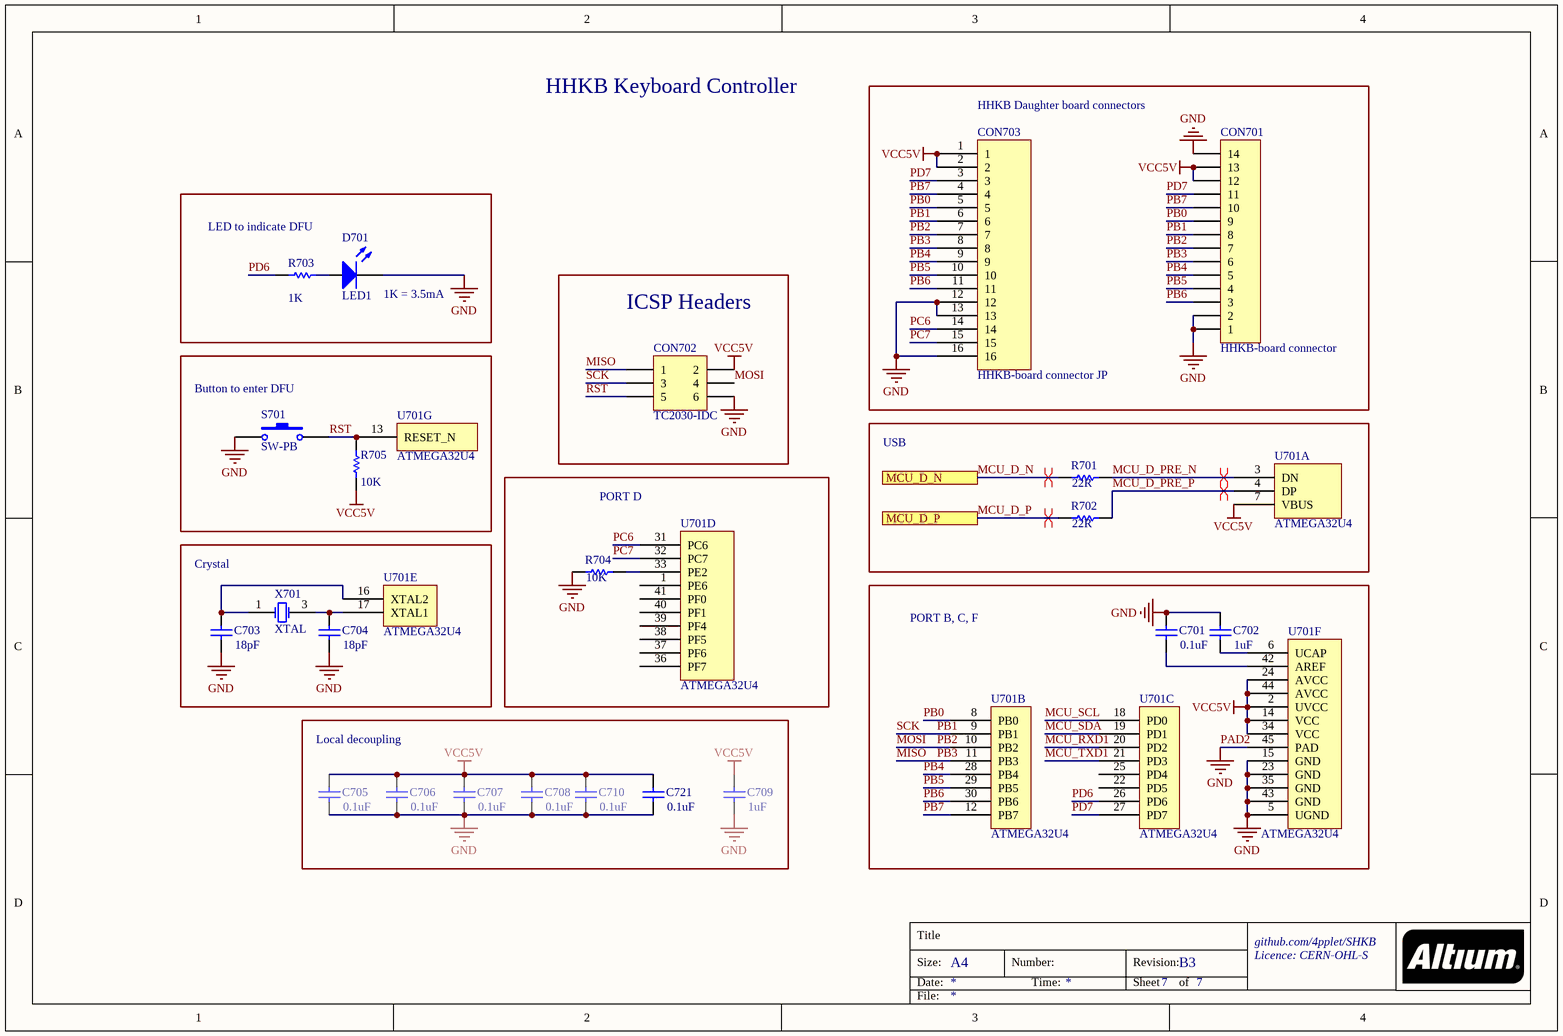
[diagram p5: 7_shkb_kbd.SchDoc]

### Parts
C701  value 0.1uF  [C0603[1608]]
C702  value 1uF  [C0603[1608]]
C703  value 18pF  [C0603[1608]]
C704  value 18pF  [C0603[1608]]
C705  value 0.1uF  [C0603[1608]]
C706  value 0.1uF  [C0603[1608]]
C707  value 0.1uF  [C0603[1608]]
C708  value 0.1uF  [C0603[1608]]
C709  value 1uF  [C0603[1608]]
C710  value 0.1uF  [C0603[1608]]
C721  value 0.1uF  [C0603[1608]]
CON701  HHKB-board connector  [JST S13B-ZR-SM4A-TF(LF)(SN)]
CON702  TC2030-IDC  [TC2030-IDC-NL]  (no BOM)
CON703  HHKB-board connector JP  [DF14A-15P-1.25H]  (no BOM)
D701  LED1  [KINGBRIGHT WP934EW]
R701  value 22R  [R0603[1608]]
R702  value 22R  [R0603[1608]]
R703  value 1K  [R0603[1608]]
R704  value 10K  [R0603[1608]]
R705  value 10K  [R0603[1608]]
S701  SW-PB  [Wurth 431256038736]
U701  ATMEGA32U4  [ATMEGA32U4]  (parts A,B,C,D,E,F,G of 7)
X701  XTAL  [XTAL-3225]

### Blocks framed on the sheet
HHKB Daughter board connectors: CON701 CON703
ICSP Headers: CON702
Button to enter DFU: R705 S701 U701
USB: R701 R702 U701
PORT D: R704 U701
Crystal: C703 C704 U701 X701
PORT B, C, F: C701 C702 U701
Local decoupling: C705-C710 C721

### Ports
MCU_D_N, MCU_D_P

### Nets
GND: C701.2 C702.2 C703.1 C704.1 C705.1 C706.1 C707.1 C708.1 C709.1 C710.1 C721.1 CON701.1 CON701.2 CON701.14 CON702.6 CON703.12 CON703.13 CON703.16 D701.1(K) R704.1 S701.2 S701.3(GND) U701.5(UGND) U701.15(GND) U701.23(GND) U701.35(GND) U701.43(GND) U701.45(PAD) X701.2(GND) X701.4(GND)  [also labelled PAD2]
VCC5V: C705.2 C706.2 C707.2 C708.2 C709.2 C710.2 C721.2 CON701.12 CON701.13 CON702.2 CON703.1 CON703.2 R705.2 U701.2(UVCC) U701.7(VBUS) U701.14(VCC) U701.24(AVCC) U701.34(VCC) U701.44(AVCC)
MCU_D_N: R701.1 ; port MCU_D_N
MCU_D_P: R702.1 ; port MCU_D_P
MCU_D_PRE_N: R701.2 U701.3(DN)
MCU_D_PRE_P: R702.2 U701.4(DP)
MCU_RXD1: U701.20(PD2)
MCU_SCL: U701.18(PD0)
MCU_SDA: U701.19(PD1)
MCU_TXD1: U701.21(PD3)
MISO: CON701.6 CON702.1 CON703.8 U701.11(PB3)  [also labelled PB3]
MOSI: CON701.7 CON702.4 CON703.7 U701.10(PB2)  [also labelled PB2]
PB0: CON701.9 CON703.5 U701.8(PB0)
PB1: CON701.8 CON702.3 CON703.6 U701.9(PB1)  [also labelled SCK]
PB4: CON701.5 CON703.9 U701.28(PB4)
PB5: CON701.4 CON703.10 U701.29(PB5)
PB6: CON701.3 CON703.11 U701.30(PB6)
PB7: CON701.10 CON703.4 U701.12(PB7)
PC6: CON703.14 U701.31(PC6)
PC7: CON703.15 U701.32(PC7)
PD6: R703.1 U701.26(PD6)
PD7: CON701.11 CON703.3 U701.27(PD7)
RST: CON702.5 R705.1 S701.1 U701.13(RESET_N)
NetC701_1: C701.1 U701.42(AREF)
NetC702_1: C702.1 U701.6(UCAP)
NetC703_2: C703.2 U701.16(XTAL2) X701.1(OSC1)
NetC704_2: C704.2 U701.17(XTAL1) X701.3(OSC2)
NetD701_2: D701.2(A) R703.2
NetR704_2: R704.2 U701.33(PE2)

Not connected (* = marked no-connect by the designer): U701 1(PE6) 22(PD5) 25(PD4) 36(PF7) 37(PF6) 38(PF5) 39(PF4) 40(PF1) 41(PF0)

### Layout directives
differential pair: MCU_D_N, MCU_D_P, MCU_D_PRE_N, MCU_D_PRE_P

### Notes on the sheet
- HHKB Keyboard Controller
- LED to indicate DFU
- (near D701) 1K = 3.5mA
- Title
- Size:
- Date:
- A4
- Number:
- Time:
- Revision:
- Sheet
- of
- File:

### Library data of the parts
C701 C705-C708 C710 C721 = Cap: as C401 on sheet 4_shkb_downstream_power; Version: 0603 imperial; JLC: BASIC; LCSC Part #: C14663
C702 C709 = Cap: as C203 on sheet 2_shkb_hub; Version: 0603 imperial; JLC: BASIC; LCSC Part #: C15849
C703 C704 = Cap: Capacitor; MRF.Part: CL10C180JB8NNNC; MFG: KEMET; MFGPN: C0603C180J5GACAUTO; LCSC MFG: Samsung Electro-Mechanics; Version: 0603 imperial; JLC: BASIC; LCSC Part #: C1647
CON701 = Header 14: MFGPN: S13B-ZR-SM4A-TF(LF)(SN); MFG: JST Sales America Inc; JLC: NONE
CON702 = Header 3X2: Header, 3-Pin, Dual row; JLC: DNP
CON703 = DF14A-15P-1.25H: MFG: Hirose Electric Co Ltd; MFGPN: DF14A-15P-1.25H(26); JLC: NONE
D701 = LED1: Typical RED GaAs LED; MRF.Part: MHK1373CGBCT; MFGPN: WP934EW/GD; MFG: Kingbright; LCSC MFG: MEIHUA; Version: Kingsbright LED; LCSC Part #: C417351; JLC: NONE
R701 R702 = Res1: Resistor; MRF.Part: 0603WAF220JT5E  0603WAF220JT5E; MFG: Vishay Dale; MFGPN: CRCW060322R0FKEAC; LCSC MFG: Uniroyal Elec; Version: 0603 imperial; JLC: BASIC; LCSC Part #: C23345
R703 = Res1: Resistor; MFG: Vishay Dale; MFGPN: 0603WAF1001T5E; LCSC MFG: Uniroyal Elec; Version: 0603 imperial; JLC: BASIC; LCSC Part #: C21190; MRF.Part: 0603WAF1001T5E
R704 R705 = Res1: as R205 on sheet 2_shkb_hub; Version: 0603 imperial; JLC: BASIC; LCSC Part #: C25804
S701 = SW-PB: Switch; MRF.Part: K2-1102AQ-C4CW-01; MFGPN: 431256038736; MFG: Wurth Electronics Inc; LCSC MFG: Korean Hroparts Elec; LCSC Part #: C127680; JLC: NONE
U701 = ATMEGA32U4: MFG: Microchip Technology; MFGPN: ATMEGA32U4-MUR; LCSC MFG: Microchip Tech; LCSC Part #: C45874; MRF.Part: ATMEGA32U4-MUR; JLC: EXTENDED
X701 = XTAL: Crystal Oscillator; MRF.Part: X322516MLB4SI; LCSC MFG: Yangxing Tech; LCSC Part #: C13738; JLC: BASIC

## Sheet 5_shkb_power_supply.SchDoc: =ProjectTitle
size A4; Address1: github.com/4pplet/SHKB; Address2: Licence: CERN-OHL-S; Revision: B3; SheetNumber: 6; SheetTotal: 7
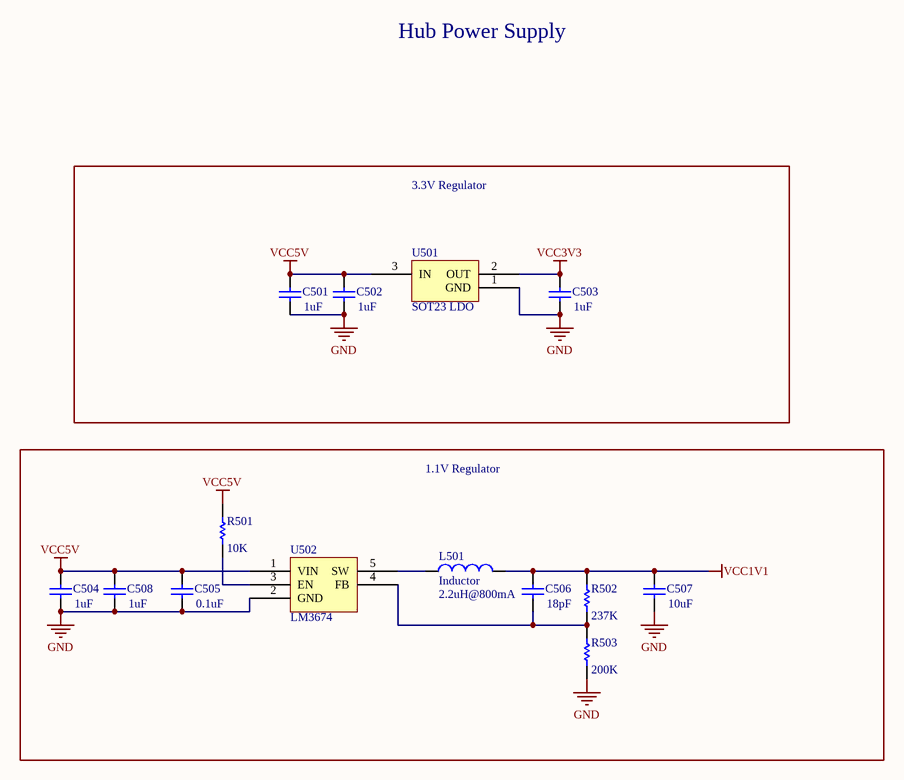
[diagram p6: 5_shkb_power_supply.SchDoc]

### Parts
C501  value 1uF  [C0603[1608]]
C502  value 1uF  [C0603[1608]]
C503  value 1uF  [C0603[1608]]
C504  value 1uF  [C0603[1608]]
C505  value 0.1uF  [C0603[1608]]
C506  value 18pF  [C0603[1608]]
C507  value 10uF  [C1206[3216]]
C508  value 1uF  [C0603[1608]]
L501  Inductor  value 2.2uH@800mA  [C0805]
R501  value 10K  [R0603[1608]]
R502  value 237K  [R0603[1608]]
R503  value 200K  [R0603[1608]]
U501  SOT23 LDO  [SOT-23-3]
U502  LM3674  [SOT-23-5]

### Blocks framed on the sheet
3.3V Regulator: C501-C503 U501
1.1V Regulator: C504-C508 L501 R501-R503 U502

### Nets
GND: C501.1 C502.1 C503.1 C504.1 C505.1 C507.1 C508.1 R503.2 U501.1(GND) U502.2(GND)
VCC1V1: C506.2 C507.2 L501.2 R502.1
VCC3V3: C503.2 U501.2(OUT)
VCC5V: C501.2 C502.2 C504.2 C505.2 C508.2 R501.1 U501.3(IN) U502.1(VIN)
NetC506_1: C506.1 R502.2 R503.1 U502.4(FB)
NetL501_1: L501.1 U502.5(SW)
NetR501_2: R501.2 U502.3(EN)

### Notes on the sheet
- Hub Power Supply
- Title
- Size:
- Date:
- A4
- Number:
- Time:
- Revision:
- Sheet
- of
- File:

### Library data of the parts
C501-C503 = Cap: Capacitor; MRF.Part: CL10A105KB8NNNC; MFG: KEMET; MFGPN: C0603C104M5RACTU; LCSC MFG: Samsung Electro-Mechanics; Version: 0603 imperial; LCSC Part #: C15849
C504 C508 = Cap: as C203 on sheet 2_shkb_hub; Version: 0603 imperial; JLC: BASIC; LCSC Part #: C15849
C505 = Cap: as C401 on sheet 4_shkb_downstream_power; Version: 0603 imperial; JLC: BASIC; LCSC Part #: C14663
C506 = Cap: as C703 on sheet 7_shkb_kbd; Version: 0603 imperial; JLC: BASIC; LCSC Part #: C1647
C507 = Cap: as C403 on sheet 4_shkb_downstream_power; Version: 1206 imperial; JLC: BASIC; LCSC Part #: C13585
L501 = Inductor: MFGPN: MLP2012S2R2MT0S1; MFG: TDK; JLC: Yes; LCSC MFG: TDK; LCSC Part #: C107322; MRF.Part: MLP2012S2R2MT0S1
R501 = Res1: as R205 on sheet 2_shkb_hub; Version: 0603 imperial; JLC: BASIC; LCSC Part #: C25804
R502 = Res1: Resistor; MRF.Part: 0603WAF2373T5E; MFG: Vishay Dale; MFGPN: CRCW0603237KFKEA; LCSC MFG: Uniroyal Elec; Version: 0603 imperial; JLC: EXTENDED; LCSC Part #: C22914
R503 = Res1: as R602 on sheet 6_shkb_upstream_con; Version: 0603 imperial; JLC: BASIC; LCSC Part #: C25811
U501 = SOT23 LDO: MRF.Part: XC6206P332MR; LCSC MFG: Torex Semicon; MFG: Texas Instruments; MFGPN: TPS7A0533PDBZ; LCSC Part #: C5446
U502 = LM3674: MFGPN: LM3674MF-ADJ/NOPB; MFG: Texas Instruments; JLC: NONE; LCSC MFG: Texas Instruments; LCSC Part #: C52027; MRF.Part: LM3674MF-ADJ/NOPB

## Nets that join several sheets
GND: 4_shkb_downstream_power (18 pins), 2_shkb_hub (32 pins), 3_shkb_downstream_con (21 pins), 6_shkb_upstream_con (17 pins), 7_shkb_kbd (30 pins), 5_shkb_power_supply (10 pins)
SHELD1: 3_shkb_downstream_con (15 pins), 6_shkb_upstream_con (7 pins)
VCC1V1: 2_shkb_hub (17 pins), 5_shkb_power_supply (C506.2 C507.2 L501.2 R502.1)
VCC3V3: 2_shkb_hub (13 pins), 6_shkb_upstream_con (R602.2 U601.8), 5_shkb_power_supply (C503.2 U501.2)
VCC5V: 4_shkb_downstream_power (9 pins), 2_shkb_hub (R204.2), 6_shkb_upstream_con (C607.2 L601.2 R603.2 U601.30), 7_shkb_kbd (19 pins), 5_shkb_power_supply (8 pins)
MCU_D_N: 2_shkb_hub (U201.2), 7_shkb_kbd (R701.1)
MCU_D_P: 2_shkb_hub (U201.1), 7_shkb_kbd (R702.1)
NetC403_2: 4_shkb_downstream_power (C403.2 U401.6), 3_shkb_downstream_con (L301.1)
NetC406_2: 4_shkb_downstream_power (C406.2 U402.6), 3_shkb_downstream_con (L302.1)
NetC409_2: 4_shkb_downstream_power (C409.2 U403.6), 3_shkb_downstream_con (L303.1)
NetR401_1: 4_shkb_downstream_power (R401.1 U401.3), 2_shkb_hub (U201.32)
NetR403_1: 4_shkb_downstream_power (R403.1 U402.3), 2_shkb_hub (U201.33)
NetR405_1: 4_shkb_downstream_power (R405.1 U403.3), 2_shkb_hub (U201.35)
NetU201_43: 4_shkb_downstream_power (U401.4), 2_shkb_hub (U201.43)
NetU201_44: 4_shkb_downstream_power (U402.4), 2_shkb_hub (U201.44)
NetU201_47: 4_shkb_downstream_power (U403.4), 2_shkb_hub (U201.47)
P1_D_N: 2_shkb_hub (U201.24), 3_shkb_downstream_con (CON301.2 D301.2)
P1_D_P: 2_shkb_hub (U201.25), 3_shkb_downstream_con (CON301.3 D301.1)
P1_SSRX_N: 2_shkb_hub (U201.30), 3_shkb_downstream_con (CON301.5 D302.2)
P1_SSRX_P: 2_shkb_hub (U201.29), 3_shkb_downstream_con (CON301.6 D302.1)
P1_SSTX_N: 2_shkb_hub (U201.27), 3_shkb_downstream_con (C303.2)
P1_SSTX_P: 2_shkb_hub (U201.26), 3_shkb_downstream_con (C302.2)
P2_D_N: 2_shkb_hub (U201.17), 3_shkb_downstream_con (CON302.2 D304.2)
P2_D_P: 2_shkb_hub (U201.18), 3_shkb_downstream_con (CON302.3 D304.1)
P2_SSRX_N: 2_shkb_hub (U201.23), 3_shkb_downstream_con (CON302.5 D305.2)
P2_SSRX_P: 2_shkb_hub (U201.22), 3_shkb_downstream_con (CON302.6 D305.1)
P2_SSTX_N: 2_shkb_hub (U201.20), 3_shkb_downstream_con (C306.1)
P2_SSTX_P: 2_shkb_hub (U201.19), 3_shkb_downstream_con (C305.1)
P3_D_N: 2_shkb_hub (U201.9), 3_shkb_downstream_con (CON303.2 D307.2)
P3_D_P: 2_shkb_hub (U201.10), 3_shkb_downstream_con (CON303.3 D307.1)
P3_SSRX_N: 2_shkb_hub (U201.15), 3_shkb_downstream_con (CON303.5 D308.2)
P3_SSRX_P: 2_shkb_hub (U201.14), 3_shkb_downstream_con (CON303.6 D308.1)
P3_SSTX_N: 2_shkb_hub (U201.12), 3_shkb_downstream_con (C308.1)
P3_SSTX_P: 2_shkb_hub (U201.11), 3_shkb_downstream_con (C309.1)
UP_D_N: 2_shkb_hub (U201.54), 6_shkb_upstream_con (CON602.A7 CON602.B7 D601.2)
UP_D_P: 2_shkb_hub (U201.53), 6_shkb_upstream_con (CON602.A6 CON602.B6 D601.1)
UP_SSRX_N: 2_shkb_hub (U201.58), 6_shkb_upstream_con (U601.10)
UP_SSRX_P: 2_shkb_hub (U201.59), 6_shkb_upstream_con (U601.9)
UP_SSTX_N: 2_shkb_hub (U201.55), 6_shkb_upstream_con (U601.7)
UP_SSTX_P: 2_shkb_hub (U201.56), 6_shkb_upstream_con (U601.6)